# EAGLE schematic Prototyp_1 (EAGLE 7.2.0)
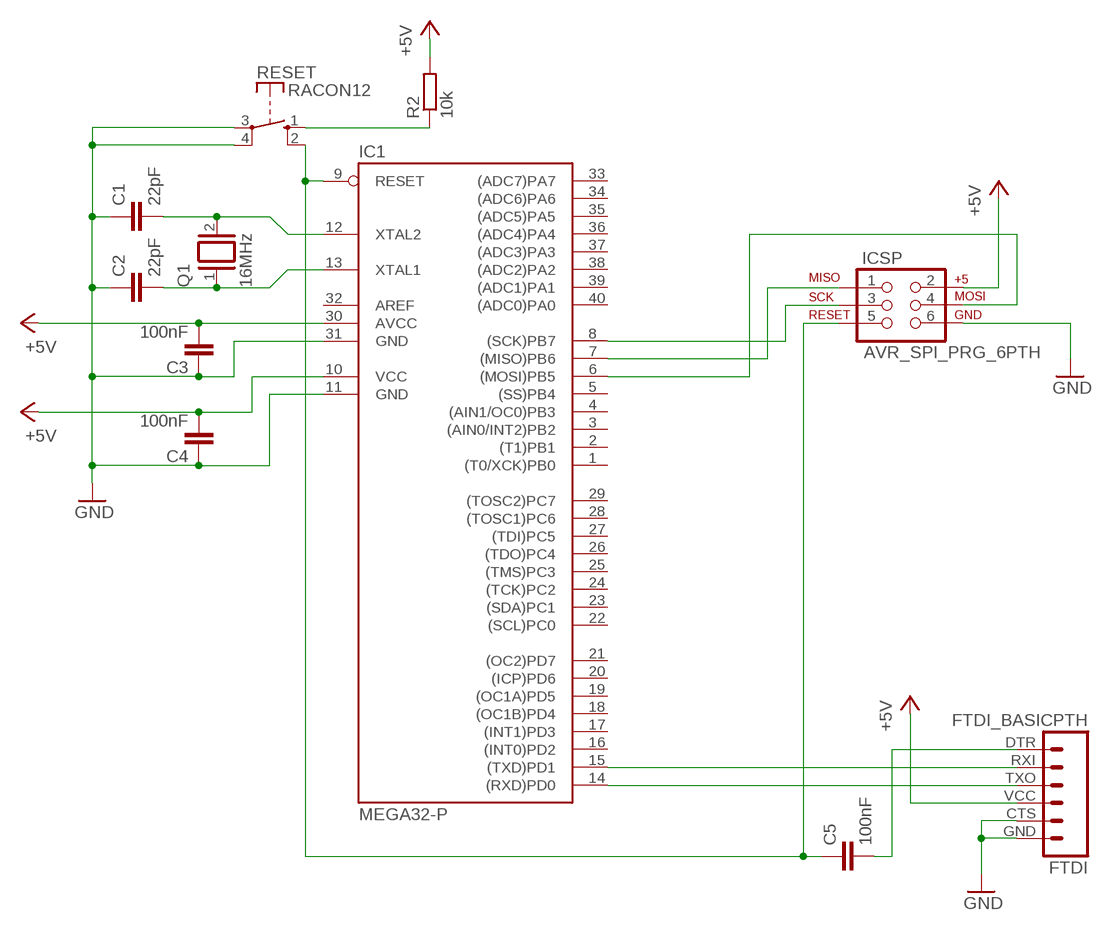
[diagram p0: schematic, sheet 1]

## Parts
C1  22pF  C-EU025-025X050  [C025-025X050]
C2  22pF  C-EU025-025X050  [C025-025X050]
C3  100nF  C-EU025-025X050  [C025-025X050]
C4  100nF  C-EU025-025X050  [C025-025X050]
C5  100nF  C-EU025-025X050  [C025-025X050]
FTDI  FTDI_BASICPTH  [FTDI_BASIC]
IC1  MEGA32-P  [DIL40]
ICSP  AVR_SPI_PRG_6PTH  [2X3]
Q1  16MHz  XTAL  [Q]
R2  10k  R-EU_0207/10  [0207/10]
RESET  RACON12  [RACON12]

## Nets
+5V: C3.2 C4.2 FTDI.VCC IC1.10(VCC) IC1.30(AVCC) ICSP.2 R2.2
GND: C1.1 C2.1 C3.1 C4.1 FTDI.CTS FTDI.GND IC1.11(GND) IC1.31(GND) ICSP.6 RESET.3(P) RESET.4(P)
N$1: C2.2 IC1.13(XTAL1) Q1.1
N$2: C1.2 IC1.12(XTAL2) Q1.2
N$3: C5.2 FTDI.DTR
N$4: C5.1 IC1.9(RESET) ICSP.5 RESET.2(S)
N$5: FTDI.RXI IC1.15((TXD)PD1)
N$6: FTDI.TXO IC1.14((RXD)PD0)
N$7: R2.1 RESET.1(S)
N$8: IC1.8((SCK)PB7) ICSP.3
N$9: IC1.7((MISO)PB6) ICSP.1
N$12: IC1.6((MOSI)PB5) ICSP.4
Unconnected: IC1.1((T0/XCK)PB0) IC1.2((T1)PB1) IC1.3((AIN0/INT2)PB2) IC1.4((AIN1/OC0)PB3) IC1.5((SS)PB4) IC1.16((INT0)PD2) IC1.17((INT1)PD3) IC1.18((OC1B)PD4) IC1.19((OC1A)PD5) IC1.20((ICP)PD6) IC1.21((OC2)PD7) IC1.22((SCL)PC0) IC1.23((SDA)PC1) IC1.24((TCK)PC2) IC1.25((TMS)PC3) IC1.26((TDO)PC4) IC1.27((TDI)PC5) IC1.28((TOSC1)PC6) IC1.29((TOSC2)PC7) IC1.32(AREF) IC1.33((ADC7)PA7) IC1.34((ADC6)PA6) IC1.35((ADC5)PA5) IC1.36((ADC4)PA4) IC1.37((ADC3)PA3) IC1.38((ADC2)PA2) IC1.39((ADC1)PA1) IC1.40((ADC0)PA0)

## Library data of the parts
C1 C2 = resistor:C-EU: CAPACITOR, European symbol
C3-C5 = rcl:C-EU: CAPACITOR, European symbol
FTDI = SparkFun-Connectors:FTDI_BASIC: FTDI Basic header with labels
IC1 = atmel:MEGA32-P: MICROCONTROLLER 32 Kbytes FLASH 2 Kbytes SRAM 1 Kbytes EEPROM USART 8-channel 10 bit ADC Source: www.atmel.com .. doc2503.pdf; MPN: ATMEGA32-16PU; OC_FARNELL: 1661729; OC_NEWARK: 51P1794
ICSP = SparkFun-Connectors:AVR_SPI_PRG_6: AVR ISP 6 Pin This is the reduced ISP connector for AVR programming. Common on Arduino. This footprint will take up less PCB space and can be used with a 10-pin to 6-pin adapter such as SKU: BOB-08508 **Special note about "TEST_POINT" package. The stop mask is on the top side, so if you want your programming test points to be on the bottom of your board, make sure to place this package on the bottom side of the board. This also ensure that the orientation to program from the bottom side will be correct.
Q1 = special:XTAL: CRYSTAL
R2 = resistor:R-EU_: RESISTOR, European symbol
RESET = switch-misc:RACON12: ITT SWITCH